# EAGLE design pendulumControl (EAGLE 7.3.0)
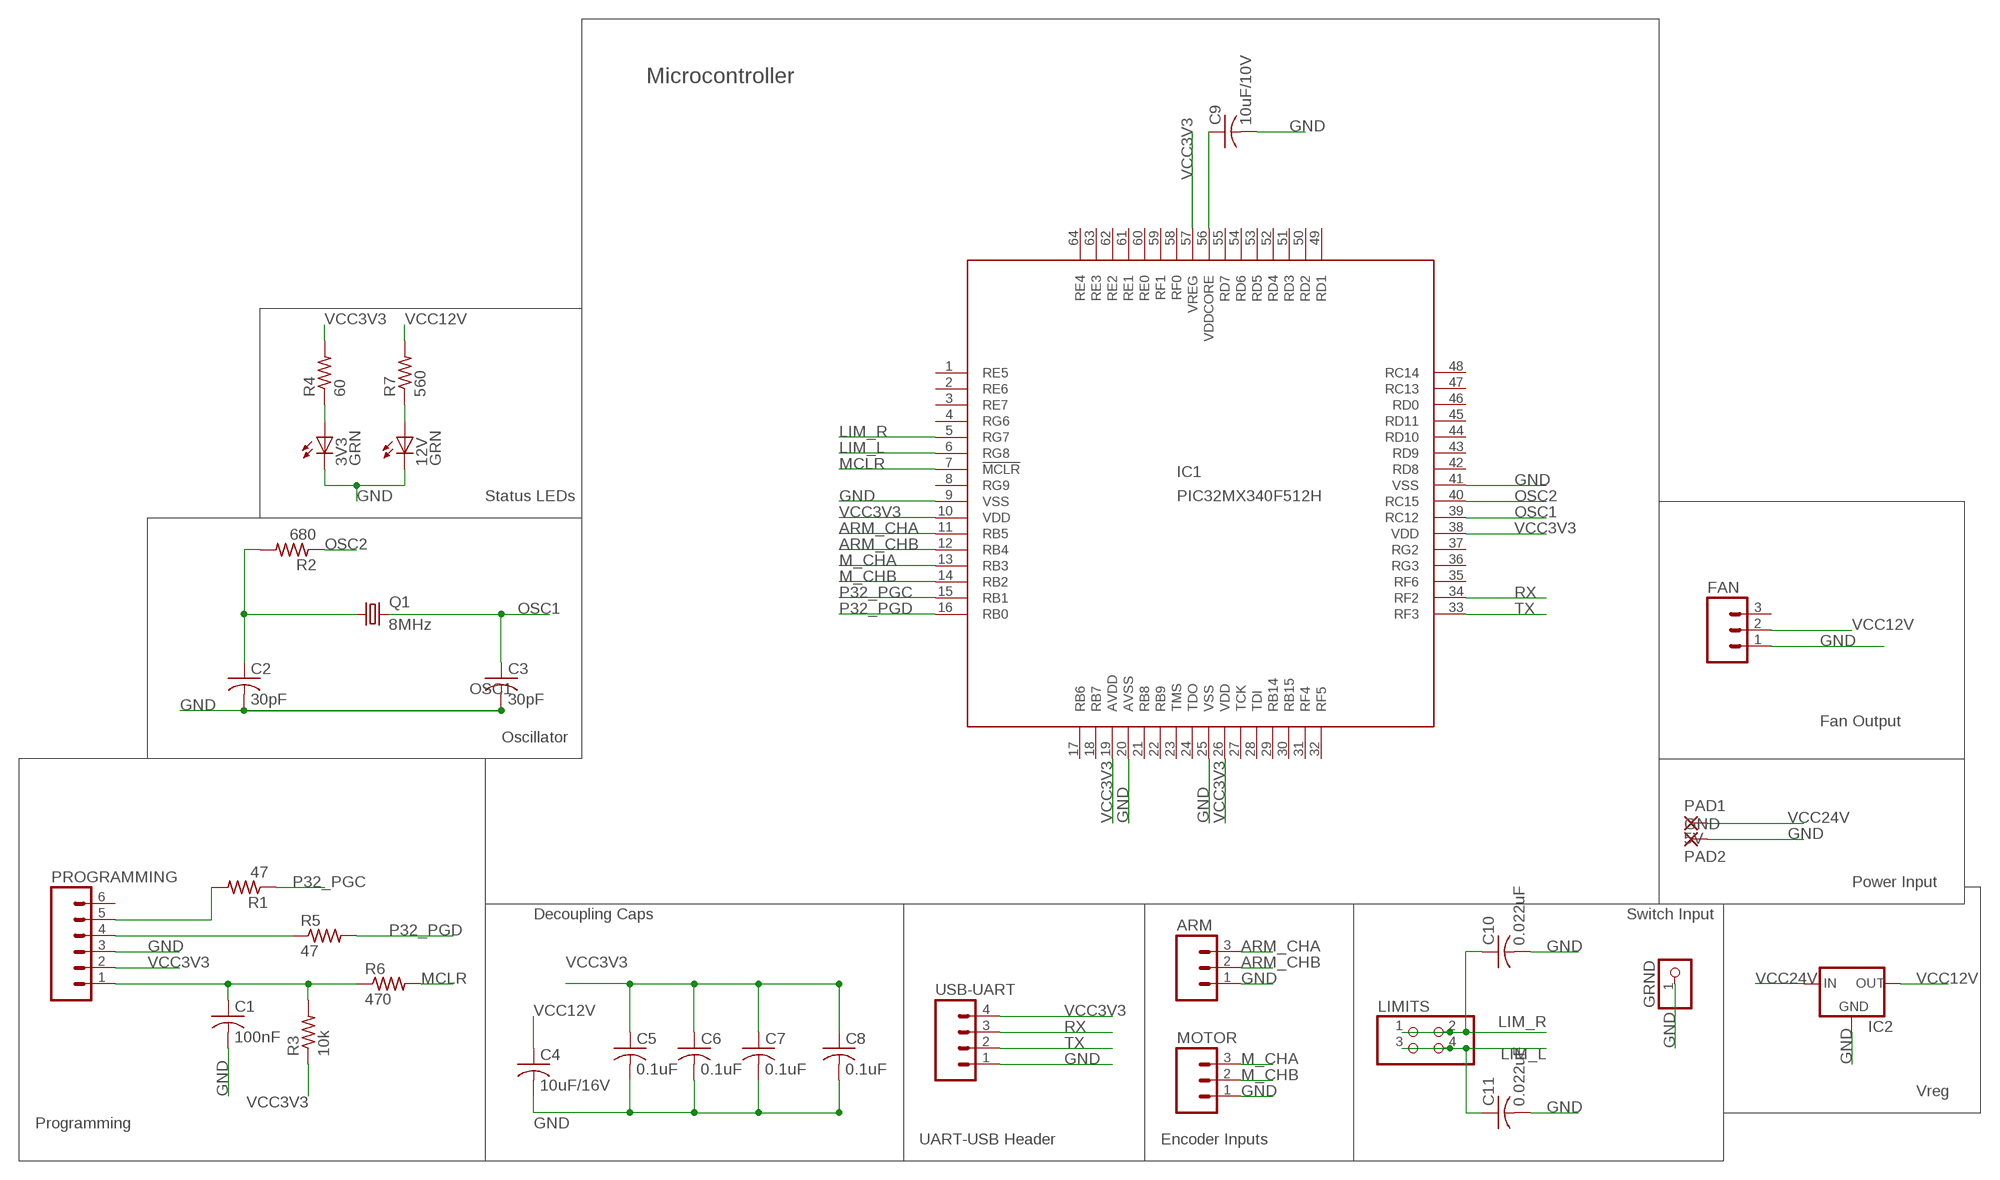
[diagram p0: schematic, sheet 1]

## Parts
3V3  GRN  LEDCHIP-LED0805  [CHIP-LED0805]
12V  GRN  LEDCHIP-LED0805  [CHIP-LED0805]
ARM  M03PTH  [1X03]
C1  100nF  C-USC0805  [C0805]
C2  30pF  C-USC0805  [C0805]
C3  30pF  C-USC0805  [C0805]
C4  10uF/16V  C-USC0805  [C0805]
C5  0.1uF  C-USC0805  [C0805]
C6  0.1uF  C-USC0805  [C0805]
C7  0.1uF  C-USC0805  [C0805]
C8  0.1uF  C-USC0805  [C0805]
C9  10uF/10V  C-USC0805  [C0805]
C10  0.022uF  C-USC0805  [C0805]
C11  0.022uF  C-USC0805  [C0805]
FAN  M03POLAR  [MOLEX-1X3]
GRND  PINHD-1X1  [1X01]
IC1  PIC32MX340F512H  [TQFP64-10X10]
IC2  78MXXS  [78MXXS]
LIMITS  PINHD-2X2  [2X02]
MOTOR  M03PTH  [1X03]
PAD1  5V  3,81/1,4  [3,81/1,4]
PAD2  GND  3,81/1,4  [3,81/1,4]
PROGRAMMING  M06FEMALE_LOCK  [1X06_FEMALE_LOCK.010]
Q1  8MHz  CRYSTALHC49S  [HC49/S]
R1  47  R-US_R0805  [R0805]
R2  680  R-US_R0805  [R0805]
R3  10k  R-US_R0805  [R0805]
R4  60  R-US_R0805  [R0805]
R5  47  R-US_R0805  [R0805]
R6  470  R-US_R0805  [R0805]
R7  560  R-US_R0805  [R0805]
USB-UART  M04PTH  [1X04]

## Nets
ARM_CHA: ARM.3 IC1.11(RB5)
ARM_CHB: ARM.2 IC1.12(RB4)
GND: 3V3.C 12V.C ARM.1 C1.2 C2.2 C3.2 C4.2 C5.2 C6.2 C7.2 C8.2 C9.2 C10.2 C11.2 FAN.1 GRND.1 IC1.9(VSS) IC1.20(AVSS) IC1.25(VSS) IC1.41(VSS) IC2.GND MOTOR.1 PAD2.1(P) PROGRAMMING.3 USB-UART.1
LIM_L: C11.1 IC1.6(RG8) LIMITS.3 LIMITS.4
LIM_R: C10.1 IC1.5(RG7) LIMITS.1 LIMITS.2
M_CHA: IC1.13(RB3) MOTOR.3
M_CHB: IC1.14(RB2) MOTOR.2
MCLR: IC1.7(!MCLR) R6.2
N$1: PROGRAMMING.4 R5.1
N$2: PROGRAMMING.5 R1.2
N$3: C2.1 Q1.1 R2.2
N$4: 3V3.A R4.1
N$5: 12V.A R7.1
N$6: C1.1 PROGRAMMING.1 R3.2 R6.1
N$10: C9.1 IC1.56(VDDCORE)
OSC1: C3.1 IC1.39(RC12) Q1.2
OSC2: IC1.40(RC15) R2.1
P32_PGC: IC1.15(RB1) R1.1
P32_PGD: IC1.16(RB0) R5.2
RX: IC1.34(RF2) USB-UART.3
TX: IC1.33(RF3) USB-UART.2
VCC3V3: C5.1 C6.1 C7.1 C8.1 IC1.10(VDD) IC1.19(AVDD) IC1.26(VDD) IC1.38(VDD) IC1.57(VREG) PROGRAMMING.2 R3.1 R4.2 USB-UART.4
VCC12V: C4.1 FAN.2 IC2.OUT R7.2
VCC24V: IC2.IN PAD1.1(P)
Unconnected: FAN.3 IC1.1(RE5) IC1.2(RE6) IC1.3(RE7) IC1.4(RG6) IC1.8(RG9) IC1.17(RB6) IC1.18(RB7) IC1.21(RB8) IC1.22(RB9) IC1.23(TMS) IC1.24(TDO) IC1.27(TCK) IC1.28(TDI) IC1.29(RB14) IC1.30(RB15) IC1.31(RF4) IC1.32(RF5) IC1.35(RF6) IC1.36(RG3) IC1.37(RG2) IC1.42(RD8) IC1.43(RD9) IC1.44(RD10) IC1.45(RD11) IC1.46(RD0) IC1.47(RC13) IC1.48(RC14) IC1.49(RD1) IC1.50(RD2) IC1.51(RD3) IC1.52(RD4) IC1.53(RD5) IC1.54(RD6) IC1.55(RD7) IC1.58(RF0) IC1.59(RF1) IC1.60(RE0) IC1.61(RE1) IC1.62(RE2) IC1.63(RE3) IC1.64(RE4) PROGRAMMING.6

## Notes on the sheet
- Microcontroller
- Status LEDs
- Fan Output
- Oscillator
- Power Input
- Decoupling Caps | Switch Input
- Vreg
- Programming
- UART-USB Header | Encoder Inputs

## Library data of the parts
3V3 12V = led:LED: LED OSRAM: - CHIPLED LG R971, LG N971, LY N971, LG Q971, LY Q971, LO R971, LY R971 LH N974, LH R974 LS Q976, LO Q976, LY Q976 LO Q996 - Hyper CHIPLED LW Q18S LB Q993, LB Q99A, LB R99A - SideLED LS A670, LO A670, LY A670, LG A670, LP A670 LB A673, LV A673, LT A673, LW A673 LH A674 LY A675 LS A676, LA A676, LO A676, LY A676, LW A676 LS A679, LY A679, LG A679 - Hyper Micro SIDELED® LS Y876, LA Y876, LO Y876, LY Y876 LT Y87S - SmartLED LW L88C, LW L88S LB L89C, LB L89S, LG L890 LS L89K, LO L89K, LY L89K LS L896, LA L896, LO L896, LY L896 - TOPLED LS T670, LO T670, LY T670, LG T670, LP T670 LSG T670, LSP T670, LSY T670, LOP T670, LYG T670 LG T671, LOG T671, LSG T671 LB T673, LV T673, LT T673, LW T673 LH T674 LS T676, LA T676, LO T676, LY T676, LB T676, LH T676, LSB T676, LW T676 LB T67C, LV T67C, LT T67C, LS T67K, LO T67K, LY T67K, LW E67C LS E67B, LA E67B, LO E67B, LY E67B, LB E67C, LV E67C, LT E67C LW T67C LS T679, LY T679, LG T679 LS T770, LO T770, LY T770, LG T770, LP T770 LB T773, LV T773, LT T773, LW T773 LH T774 LS E675, LA E675, LY E675, LS T675 LS T776, LA T776, LO T776, LY T776, LB T776 LHGB T686 LT T68C, LB T68C - Hyper Mini TOPLED® LB M676 - Mini TOPLED Santana® LG M470 LS M47K, LO M47K, LY M47K Source: http://www.osram.convergy.de LUXEON: - LUMILED® LXK2-PW12-R00, LXK2-PW12-S00, LXK2-PW14-U00, LXK2-PW14-V00 LXK2-PM12-R00, LXK2-PM12-S00, LXK2-PM14-U00 LXK2-PE12-Q00, LXK2-PE12-R00, LXK2-PE12-S00, LXK2-PE14-T00, LXK2-PE14-U00 LXK2-PB12-K00, LXK2-PB12-L00, LXK2-PB12-M00, LXK2-PB14-N00, LXK2-PB14-P00, LXK2-PB14-Q00 LXK2-PR12-L00, LXK2-PR12-M00, LXK2-PR14-Q00, LXK2-PR14-R00 LXK2-PD12-Q00, LXK2-PD12-R00, LXK2-PD12-S00 LXK2-PH12-R00, LXK2-PH12-S00 LXK2-PL12-P00, LXK2-PL12-Q00, LXK2-PL12-R00 Source: www.luxeon.com KINGBRIGHT: KA-3528ASYC Source: www.kingbright.com
ARM FAN MOTOR = SparkFun-Connectors:M03: Header 3 Standard 3-pin 0.1" header. Use with straight break away headers (SKU : PRT-00116), right angle break away headers (PRT-00553), swiss pins (PRT-00743), machine pins (PRT-00117), and female headers (PRT-00115). Molex polarized connector foot print use with SKU : PRT-08232 with associated crimp pins and housings.
C1-C5 C9-C11 = rcl:C-US: CAPACITOR, American symbol
C6-C8 = resistor:C-US: CAPACITOR, American symbol
GRND = pinhead:PINHD-1X1: PIN HEADER
IC1 = microchip:PIC32MX340F*H: PIC32MX340FxxxH Source: http://ww1.microchip.com/downloads/en/DeviceDoc/61143E.pdf, PIC32MX320F064H.bsdl; MPN: PIC32MX340F512H-80I/PT; OC_FARNELL: 1677915; OC_NEWARK: 98M1931
IC2 = v-reg:78MXXS: VOLTAGE REGULATOR
LIMITS = pinhead:PINHD-2X2: PIN HEADER
PAD1 PAD2 = wirepad:3,81/1,4: THROUGH-HOLE PAD
PROGRAMMING = SparkFun-Connectors:M06: Header 6 Standard 6-pin 0.1" header. Use with straight break away headers (SKU : PRT-00116), right angle break away headers (PRT-00553), swiss pins (PRT-00743), machine pins (PRT-00117), and female headers (PRT-00115). Molex polarized connector foot print use with SKU : PRT-08094 with associated crimp pins and housings. NOTES ON THE VARIANTS LOCK and LOCK_LONGPADS... This footprint was designed to help hold the alignment of a through-hole component (i.e. 6-pin header) while soldering it into place. You may notice that each hole has been shifted either up or down by 0.005 of an inch from it's more standard position (which is a perfectly straight line). This slight alteration caused the pins (the squares in the middle) to touch the edges of the holes. Because they are alternating, it causes a "brace" to hold the component in place. 0.005 has proven to be the perfect amount of "off-center" position when using our standard breakaway headers. Although looks a little odd when you look at the bare footprint, once you have a header in there, the alteration is very hard to notice. Also,if you push a header all the way into place, it is covered up entirely on the bottom side. This idea of altering the position of holes to aid alignment will be further integrated into the Sparkfun Library for other footprints. It can help hold any component with 3 or more connection pins.
Q1 = crystal:CRYSTAL: CRYSTAL; OC_FARNELL: 1667008; OC_NEWARK: unknown
R1 R3 R5 R6 = resistor:R-US_: RESISTOR, American symbol
R2 R4 R7 = rcl:R-US_: RESISTOR, American symbol
USB-UART = SparkFun-Connectors:M04: Header 4 Standard 4-pin 0.1" header. Use with straight break away headers (SKU : PRT-00116), right angle break away headers (PRT-00553), swiss pins (PRT-00743), machine pins (PRT-00117), and female headers (PRT-00115). Molex polarized connector foot print use with SKU : PRT-08231 with associated crimp pins and housings. 1MM SMD Version SKU: PRT-10208

## Board
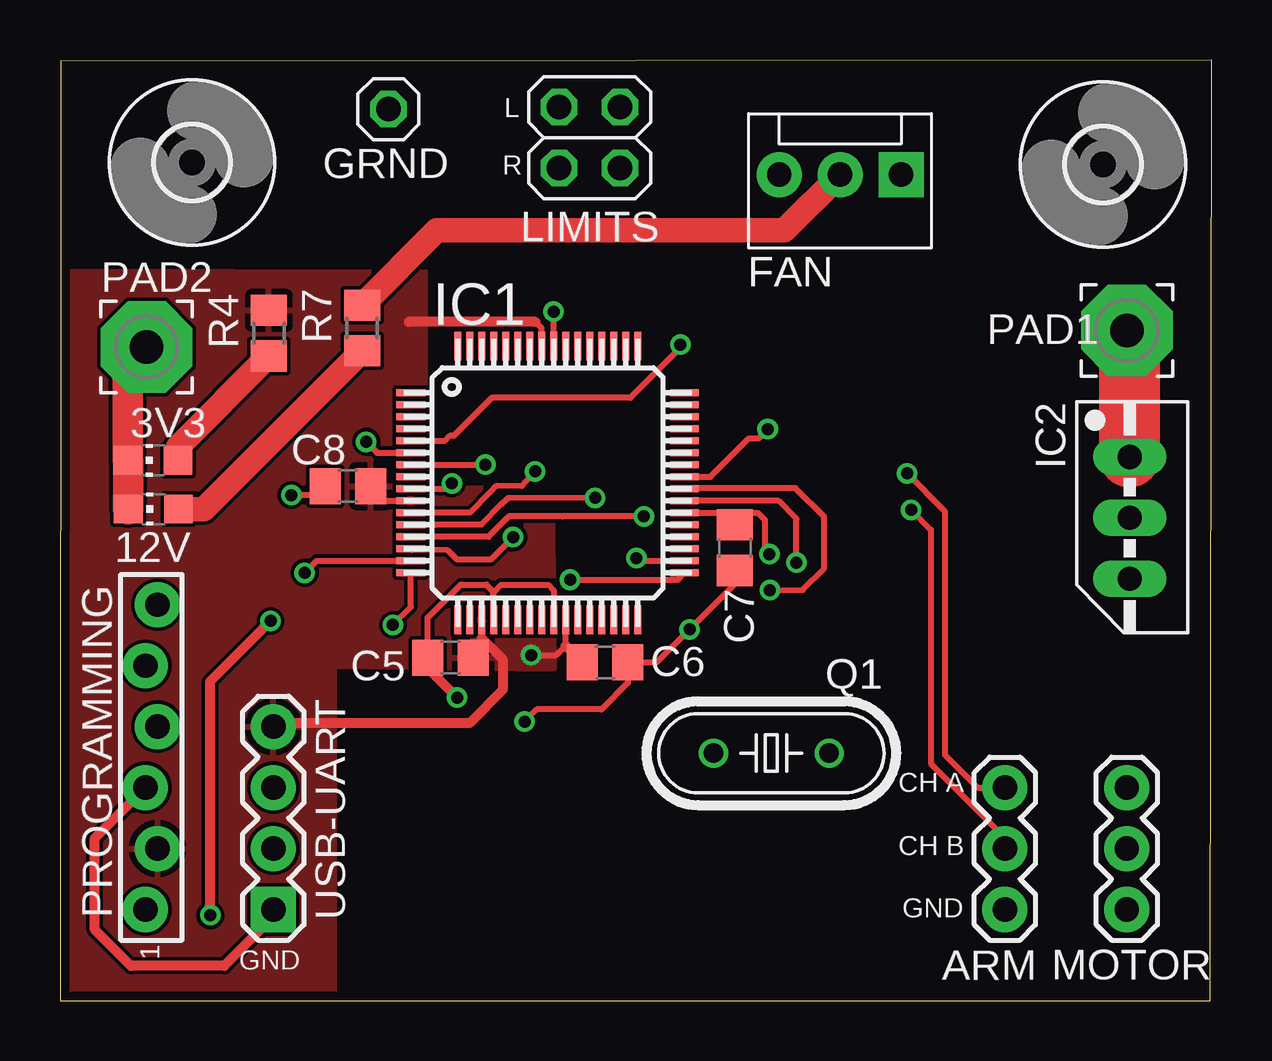
[diagram p1: board, top side]
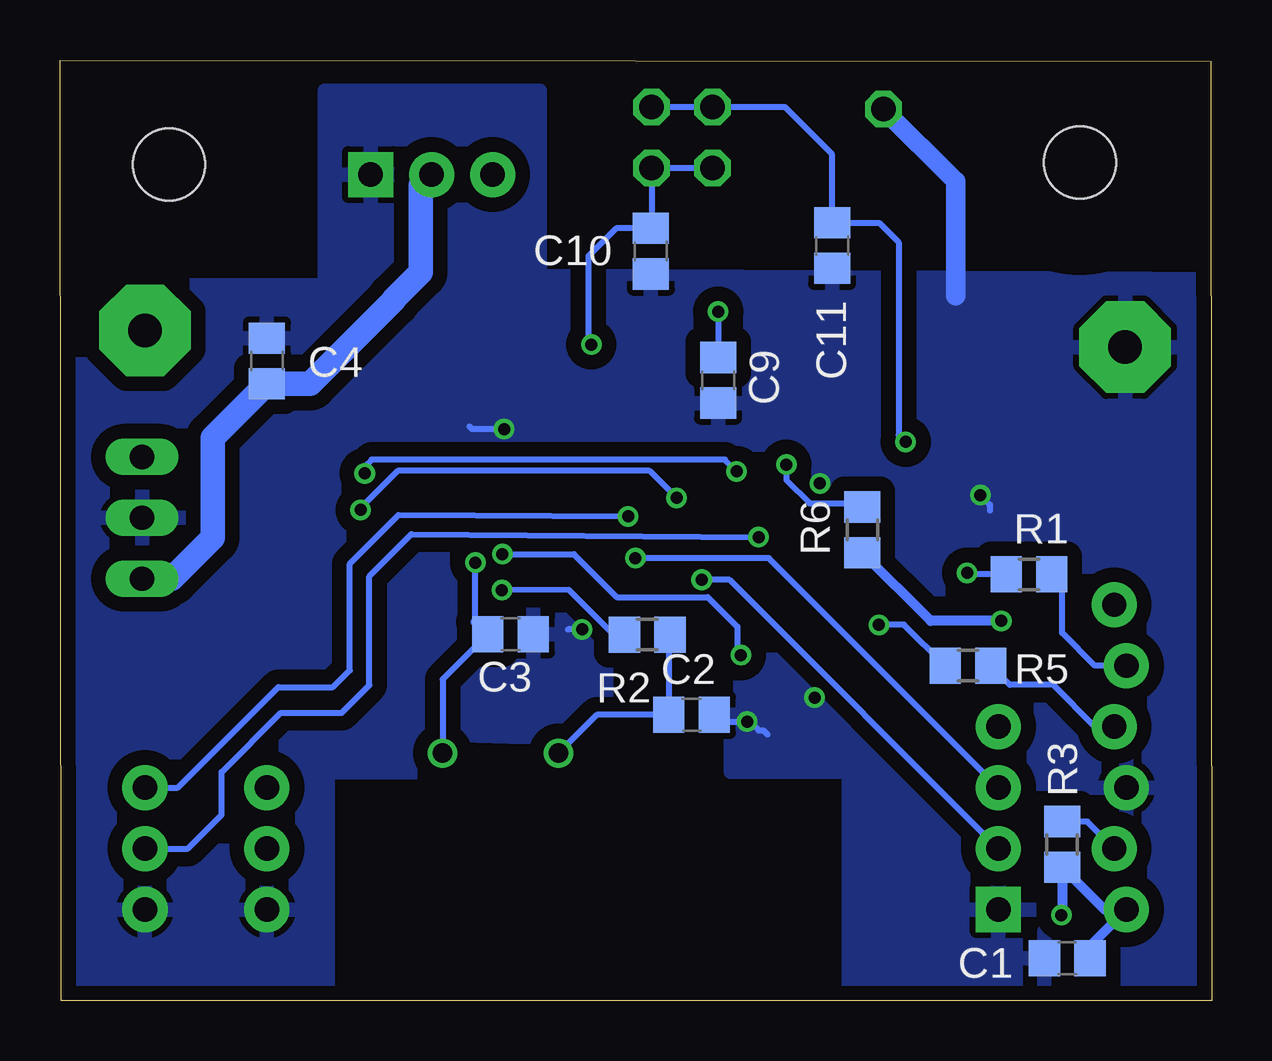
[diagram p2: board, bottom side, seen from below]

Size 47.99 x 39.21 mm. Coordinates in mm from the lower left corner, seen from the top.
Outline: 0,0 47.93,0 47.99,39.21 0.04,39.16 0,0
Copper layers (1*16): Top 0.0356mm / dielectric 1.5011mm / Bottom 0.0356mm
Design rules "oshpark": minimum track width 6mil, minimum drill 13mil, track to track 6mil, track to pad 6mil, pad to pad 6mil, via to via 6mil, smd to smd 6mil, copper to edge 15mil, drill to drill 6mil, minimum pad ring 7mil, minimum via ring 7mil, stop-mask expansion 3mil, vias tented up to drill 0mil, thermal gap 10mil

### Footprints (pad centres in the part's own frame; a part is rotated, then mirrored left to right if it is on the bottom)
CHIP-LED0805 = smd 1.2 x 1.2: A 0,-1.05; C 0,1.05
1X03 = drill 1.016 pad 1.88: 1 0,0; 2 2.54,0; 3 5.08,0
C0805 = smd 1.3 x 1.5: 1 -0.95,0; 2 0.95,0
MOLEX-1X3 = drill 1.016 pad 1.88 square: 1 0,0 | drill 1.016 pad 1.88: 2 2.54,0; 3 5.08,0
1X01 = drill 1.016 octagon: 1 0,0
TQFP64-10X10 = smd 1.2 x 0.3: 1 -5.7,3.75; 2 -5.7,3.25; 3 -5.7,2.75; 4 -5.7,2.25; 5 -5.7,1.75; 6 -5.7,1.25; 7 -5.7,0.75; 8 -5.7,0.25; 9 -5.7,-0.25; 10 -5.7,-0.75; 11 -5.7,-1.25; 12 -5.7,-1.75; 13 -5.7,-2.25; 14 -5.7,-2.75; 15 -5.7,-3.25; 16 -5.7,-3.75; 33 5.7,-3.75; 34 5.7,-3.25; 35 5.7,-2.75; 36 5.7,-2.25; 37 5.7,-1.75; 38 5.7,-1.25; 39 5.7,-0.75; 40 5.7,-0.25; 41 5.7,0.25; 42 5.7,0.75; 43 5.7,1.25; 44 5.7,1.75; 45 5.7,2.25; 46 5.7,2.75; 47 5.7,3.25; 48 5.7,3.75 | smd 0.3 x 1.2: 17 -3.75,-5.7; 18 -3.25,-5.7; 19 -2.75,-5.7; 20 -2.25,-5.7; 21 -1.75,-5.7; 22 -1.25,-5.7; 23 -0.75,-5.7; 24 -0.25,-5.7; 25 0.25,-5.7; 26 0.75,-5.7; 27 1.25,-5.7; 28 1.75,-5.7; 29 2.25,-5.7; 30 2.75,-5.7; 31 3.25,-5.7; 32 3.75,-5.7; 49 3.75,5.7; 50 3.25,5.7; 51 2.75,5.7; 52 2.25,5.7; 53 1.75,5.7; 54 1.25,5.7; 55 0.75,5.7; 56 0.25,5.7; 57 -0.25,5.7; 58 -0.75,5.7; 59 -1.25,5.7; 60 -1.75,5.7; 61 -2.25,5.7; 62 -2.75,5.7; 63 -3.25,5.7; 64 -3.75,5.7
78MXXS = drill 1.016 long: GND 0,-2.54; IN -2.54,-2.54; OUT 2.54,-2.54
2X02 = drill 1.016 octagon: 1 -1.27,-1.27; 2 -1.27,1.27; 3 1.27,-1.27; 4 1.27,1.27
3,81/1,4 = drill 1.397 pad 3.81 octagon: 1 0,0
1X06_FEMALE_LOCK.010 = drill 1.016 pad 1.88: 1 0,0.254; 2 2.54,-0.254; 3 5.08,0.254; 4 7.62,-0.254; 5 10.16,0.254; 6 12.7,-0.254
HC49/S = drill 0.813: 1 -2.413,0; 2 2.413,0
R0805 = smd 1.3 x 1.5: 1 -0.95,0; 2 0.95,0
3,0 = hole 3: 0,0
1X04 = drill 1.016 pad 1.88 square: 1 0,0 | drill 1.016 pad 1.88: 2 2.54,0; 3 5.08,0; 4 7.62,0

### Placement (x,y rotation side)
3V3  3.87,22.53 90 top
12V  3.89,20.5 90 top
ARM  39.37,3.81 90 top
C1  6.02,1.78 180 bottom
C2  21.68,11.92 0 bottom
C3  29.22,15.28 0 bottom
C4  39.37,26.67 90 bottom
C5  16.27,14.31 180 top
C6  22.71,14.1 0 top
C7  28.12,18.89 270 top
C8  12,21.45 180 top
C9  20.57,25.87 270 bottom
C10  23.38,31.24 270 bottom
C11  15.81,31.47 270 bottom
FAN  35.05,34.43 180 top
GRND  13.68,37.16 0 top
IC1  20.32,21.59 0 top
IC2  47.11,20.13 270 top
LIMITS  22.07,35.98 90 top
MOTOR  44.45,3.81 90 top
PAD1  44.45,27.94 0 top
PAD2  3.61,27.24 0 top
PROGRAMMING  3.81,3.81 90 top
Q1  29.64,10.33 0 top
R1  7.62,17.78 0 bottom
R2  23.52,15.27 0 bottom
R3  6.23,6.53 270 bottom
R4  8.7,27.83 90 top
R5  10.16,13.97 180 bottom
R6  14.56,19.63 90 bottom
R7  12.58,28.04 90 top
U$1  [3,0]  5.5,34.94 0 top
U$2  [3,0]  43.46,34.86 0 top
USB-UART  8.89,3.81 90 top

### Tracks (layer width: path | path; a pad name or v marks a point on that pad's centre or on a via)
ARM_CHA  (via drill 0.5)
  Top 0.254: v19.8,22.07 19.24,21.45 18.18,21.46 17.92,21.2 17.09,20.35 15.38,20.34 IC1.11 | v35.29,21.98 36.87,20.4 36.87,10.25 38.23,8.89 ARM.3
  Bottom 0.254: v19.8,22.07 20.29,22.56 35.01,22.56 35.29,22.27 v35.29,21.98
ARM_CHB  (via drill 0.5)
  Top 0.254: v22.3,20.96 18.67,20.95 18.41,20.71 17.56,19.84 15.61,19.84 IC1.12 | v35.47,20.46 36.28,19.64 36.28,9.89 39.37,6.81 ARM.2
  Bottom 0.254: 35.47,20.56 v35.47,20.46 35.47,20.55 33.92,22.09 23.43,22.09 v22.3,20.96
GND  (via drill 0.5)
  Top 0.254: IC1.20 | C8.2 10.68,21.08 v9.64,21.08 | USB-UART.1 8.89,3.51 | IC1.9 16.1,21.34 v16.33,21.57 | 15.32,13.86 C5.2 15.32,15.97 16.7,17.35 17.77,17.35 18.04,17.08 18.04,15.92 IC1.20 | IC1.20 18.07,17.04 18.37,17.34 20.36,17.34 20.57,17.12 IC1.25 | v19.36,11.64 19.86,12.15 22.56,12.15 23.66,13.25 C6.2 24.86,14.1 v26.24,15.48 28.12,17.37 C7.2 | IC1.41 27.1,21.84 28.7,23.44 29.11,23.44 v29.49,23.83
  Top 0.406: 8.89,3.51 6.85,1.47 2.95,1.47 1.45,2.97 1.45,6.78 PROGRAMMING.3 | 15.32,13.86 v16.55,12.64
  Top 1.016: 2.84,22.51 3V3.C | 2.82,26.45 PAD2.1
  Top 1.27: 12V.C 2.84,22.51 | 3V3.C 2.82,26.45
  Bottom 0.254: v9.64,21.08 9.24,20.68 9.24,20.43 | v16.33,21.57 16.58,21.57 16.6,21.59 | v16.55,12.64 16.76,12.64 16.85,12.72 | v26.24,15.48 26.81,15.48 26.82,15.47 | 18.52,11.1 18.68,11.27 18.89,11.27 19.26,11.64 v19.36,11.64 20.45,11.64 C2.2 | v29.49,23.83 30.82,23.83 30.92,23.93
  Bottom 0.813: GRND.1 10.67,34.15 10.67,29.39
  pour Bottom (isolate 0.61): -1.75,30.08 -2.54,-1.27 15.13,-1.32 15.13,9.56 20.04,9.56 20.04,18.5 25.22,18.5 25.24,10.88 31.32,11.07 31.32,9.52 36.84,9.51 36.84,-1.51 50.3,-1.77 49.86,29.82 36.97,29.82 36.97,37.92 28,37.92 28,30.22
LIM_L  (via drill 0.5)
  Top 0.254: v12.75,23.3 13.21,22.84 IC1.6
  Bottom 0.254: 20.79,37.24 17.78,37.24 15.81,35.27 C11.1 13.86,32.42 13.04,31.61 13.04,23.59 v12.75,23.3 | LIMITS.4 LIMITS.3
  Bottom 0.406: 20.79,37.24 LIMITS.4
LIM_R  (via drill 0.5)
  Top 0.254: v25.85,27.35 25.85,27.23 23.76,25.13 17.99,25.13 16.4,23.54 16.23,23.54 16.02,23.33 IC1.5
  Bottom 0.254: LIMITS.2 LIMITS.1 23.34,32.23 | C10.1 24.82,32.2 25.98,31.04 25.98,27.48 v25.85,27.35
  Bottom 0.406: 23.34,32.23 C10.1
M_CHA  (via drill 0.5)
  Top 0.254: v24.32,20.2 20.93,20.2 18.71,20.2 18.62,20.11 17.85,19.34 15.91,19.34 IC1.13
  Bottom 0.254: v24.32,20.2 33.88,20.26 35.92,18.22 35.92,13.78 36.62,13.07 38.9,13.07 43.08,8.89 MOTOR.3
M_CHB  (via drill 0.5)
  Top 0.254: v18.88,19.33 18.85,19.29 17.95,18.4 16.55,18.4 16.16,18.78 14.66,18.8 IC1.14
  Bottom 0.254: v18.88,19.33 33.35,19.45 35.1,17.7 35.1,13.16 36.26,12.01 38.78,12.01 41.26,9.53 41.26,7.76 42.67,6.35 MOTOR.2
MCLR  (via drill 0.5)
  Top 0.254: IC1.7 v17.72,22.34 v17.73,22.35
  Bottom 0.254: v17.73,22.35 17.73,21.7 16.76,20.73 14.71,20.73 R6.2
N$1
  Bottom 0.254: PROGRAMMING.4 4.87,11.43 6.61,13.17 8.41,13.17 R5.1
N$2
  Bottom 0.254: PROGRAMMING.5 4.87,13.97 6.24,15.34 6.24,17.35 R1.2
N$3
  Bottom 0.254: R2.2 22.63,15.22 C2.1 25.63,11.92 Q1.1
N$4
  Top 1.016: 3V3.A 4.92,23.09 R4.1
N$5
  Top 1.016: 12V.A 5.99,20.5 R7.1
N$6  (via drill 0.5)
  Top 0.406: v6.26,3.58 6.26,13.32 v8.77,15.83
  Bottom 0.254: 6.24,3.61 v6.26,3.58
  Bottom 0.406: C1.1 5.09,2.28 PROGRAMMING.1 4.47,3.81 R3.2 6.24,3.61 | v8.77,15.83 11.71,15.83 R6.1
N$10  (via drill 0.5)
  Top 0.254: IC1.56 v20.57,28.73
  Bottom 0.254: v20.57,28.73 C9.1
OSC1  (via drill 0.5)
  Top 0.254: v30.68,18.27 30.68,20.09 29.94,20.83 IC1.39
  Bottom 0.254: C3.1 32.05,13.4 Q1.2 | 30.68,15.79 v30.68,18.27
  Bottom 0.406: C3.1 30.68,15.79
OSC2  (via drill 0.5)
  Top 0.254: v29.58,17.12 30.95,17.13 31.84,18.02 31.84,20.17 30.64,21.37 26.05,21.37 IC1.40
  Bottom 0.254: v29.58,17.12 26.79,17.13 24.93,15.27 R2.1
P32_PGC  (via drill 0.5)
  Top 0.254: v10.19,17.84 10.69,18.34 IC1.15
  Bottom 0.254: R1.1 10.13,17.78 v10.19,17.84
P32_PGD  (via drill 0.5)
  Top 0.254: v13.87,15.67 14.62,16.42 IC1.16
  Bottom 0.254: R5.2 12.82,15.69 v13.87,15.67
RX  (via drill 0.5)
  Top 0.254: v24.02,18.45 24.13,18.34 IC1.34
  Bottom 0.254: USB-UART.3 18.45,18.45 v24.02,18.45
TX  (via drill 0.5)
  Top 0.254: v21.25,17.55 25.73,17.55 IC1.33
  Bottom 0.254: USB-UART.2 20.09,17.55 v21.25,17.55
VCC3V3  (via drill 0.5)
  Top 0.254: C8.1 13.56,20.84 IC1.10 | C5.1 17.57,14.66 IC1.19 17.57,15.11 | 9.04,11.58 USB-UART.4 | IC1.26 21.07,14.8 20.68,14.41 v19.62,14.41 | IC1.57 20.07,28.03 19.8,28.3 | C7.1 27.62,20.34 IC1.38 29.08,20.34 29.36,20.05 29.36,18.82 v29.56,18.62
  Top 0.406: 17.57,15.11 18.45,14.23 18.45,12.96 17.06,11.58 9.04,11.58 | C6.1 21.07,14.8 | 19.8,28.3 14.54,28.3
  Bottom 0.254: PROGRAMMING.2 5.19,7.47 R3.1 | v29.56,18.62 26.59,18.62 24.8,16.83 21.01,16.83 19.77,15.6 19.77,14.55 v19.62,14.41
  pour Top: 0,0 11.43,0 11.43,13.97 20.59,13.85 20.52,21.33 15.19,21.36 15.23,30.34 -0.79,30.38
VCC12V
  Top 1.016: R7.2 15.71,32.11 30.19,32.11 FAN.2
  Bottom 1.016: IC2.OUT 43.34,17.59 41.63,19.3 41.63,23.46 C4.1 37.57,25.72 34.09,29.21 34.09,29.24 32.95,30.37 32.95,33.98 FAN.2
VCC24V
  Top 2.54: IC2.IN 44.57,27.82 PAD1.1

### Text on the board
tNames: L | R | FAN | CH A | CH B | GND | 1 | GND